# Altium schematic sheet fda.SchDoc
size A4
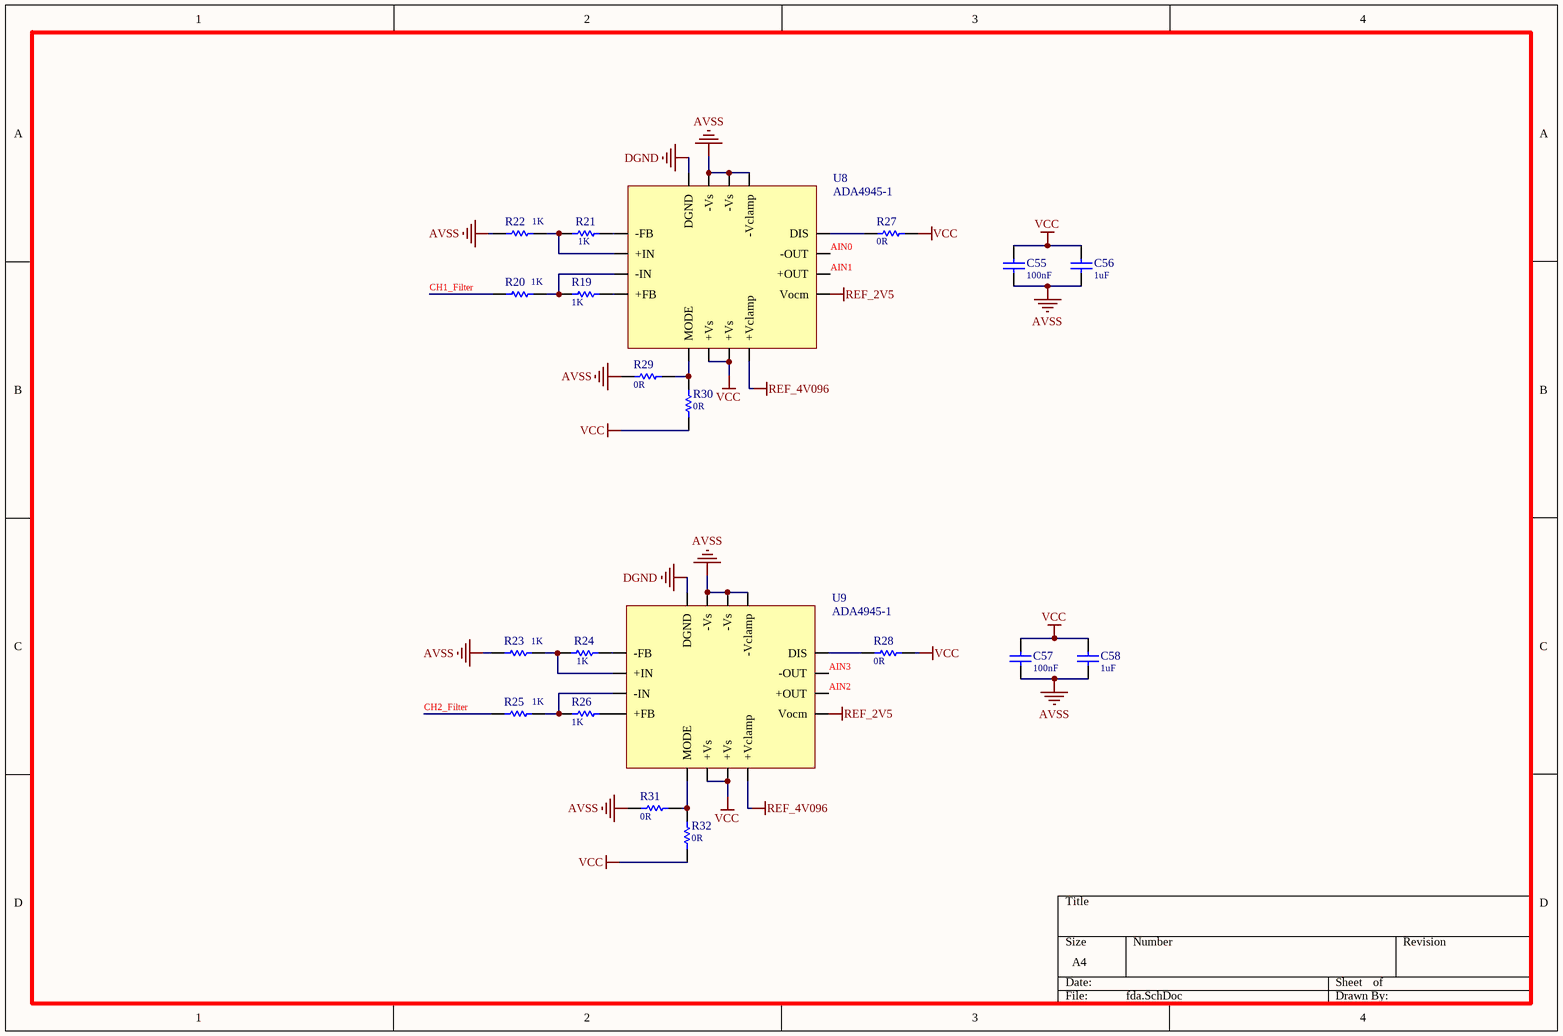
[diagram p0: fda.SchDoc]

## Parts
C55  value 100nF  [C0603-L]  (hidden comment: Cap-S)
C56  value 1uF  [C0603-L]  (hidden comment: Cap-S)
C57  value 100nF  [C0603-L]  (hidden comment: Cap-S)
C58  value 1uF  [C0603-L]  (hidden comment: Cap-S)
R19  value 1K  [R0603-L]  (hidden comment: R)
R20  value 1K  [R0603-L]  (hidden comment: R)
R21  value 1K  [R0603-L]  (hidden comment: R)
R22  value 1K  [R0603-L]  (hidden comment: R)
R23  value 1K  [R0603-L]  (hidden comment: R)
R24  value 1K  [R0603-L]  (hidden comment: R)
R25  value 1K  [R0603-L]  (hidden comment: R)
R26  value 1K  [R0603-L]  (hidden comment: R)
R27  value 0R  [R0603-L]  (hidden comment: R)
R28  value 0R  [R0603-L]  (hidden comment: R)
R29  value 0R  [R0603-L]  (hidden comment: R)
R30  value 0R  [R0603-L]  (hidden comment: R)
R31  value 0R  [R0603-L]  (hidden comment: R)
R32  value 0R  [R0603-L]  (hidden comment: R)
U8  ADA4945-1  [CP_16_22]
U9  ADA4945-1  [CP_16_22]

## Nets
AVSS: C55.1 C56.1 C57.1 C58.1 R22.1 R23.1 R29.2 R31.2 U8.13(-Vclamp) U8.14(-Vs) U8.15(-Vs) U9.13(-Vclamp) U9.14(-Vs) U9.15(-Vs)
DGND: U8.16(DGND) U9.16(DGND)
REF_2V5: U8.9(Vocm) U9.9(Vocm)
REF_4V096: U8.8(+Vclamp) U9.8(+Vclamp)
VCC: C55.2 C56.2 C57.2 C58.2 R27.2 R28.2 R30.2 R32.2 U8.6(+Vs) U8.7(+Vs) U9.6(+Vs) U9.7(+Vs)
AIN0: U8.11(-OUT)
AIN1: U8.10(+OUT)
AIN2: U9.10(+OUT)
AIN3: U9.11(-OUT)
CH1_Filter: R20.1
CH2_Filter: R25.1
NetR19_1: R19.1 R20.2 U8.3(-IN)
NetR19_2: R19.2 U8.4(+FB)
NetR21_1: R21.1 R22.2 U8.2(+IN)
NetR21_2: R21.2 U8.1(-FB)
NetR23_2: R23.2 R24.1 U9.2(+IN)
NetR24_2: R24.2 U9.1(-FB)
NetR25_2: R25.2 R26.1 U9.3(-IN)
NetR26_2: R26.2 U9.4(+FB)
NetR27_1: R27.1 U8.12(DIS)
NetR28_1: R28.1 U9.12(DIS)
NetR29_1: R29.1 R30.1 U8.5(MODE)
NetR31_1: R31.1 R32.1 U9.5(MODE)

## Library data of the parts
C55-C58 = Cap-S: 贴片瓷片电容
R19-R32 = Res: 贴片电阻